# Altium project ENOCHv1.0.PrjPcb
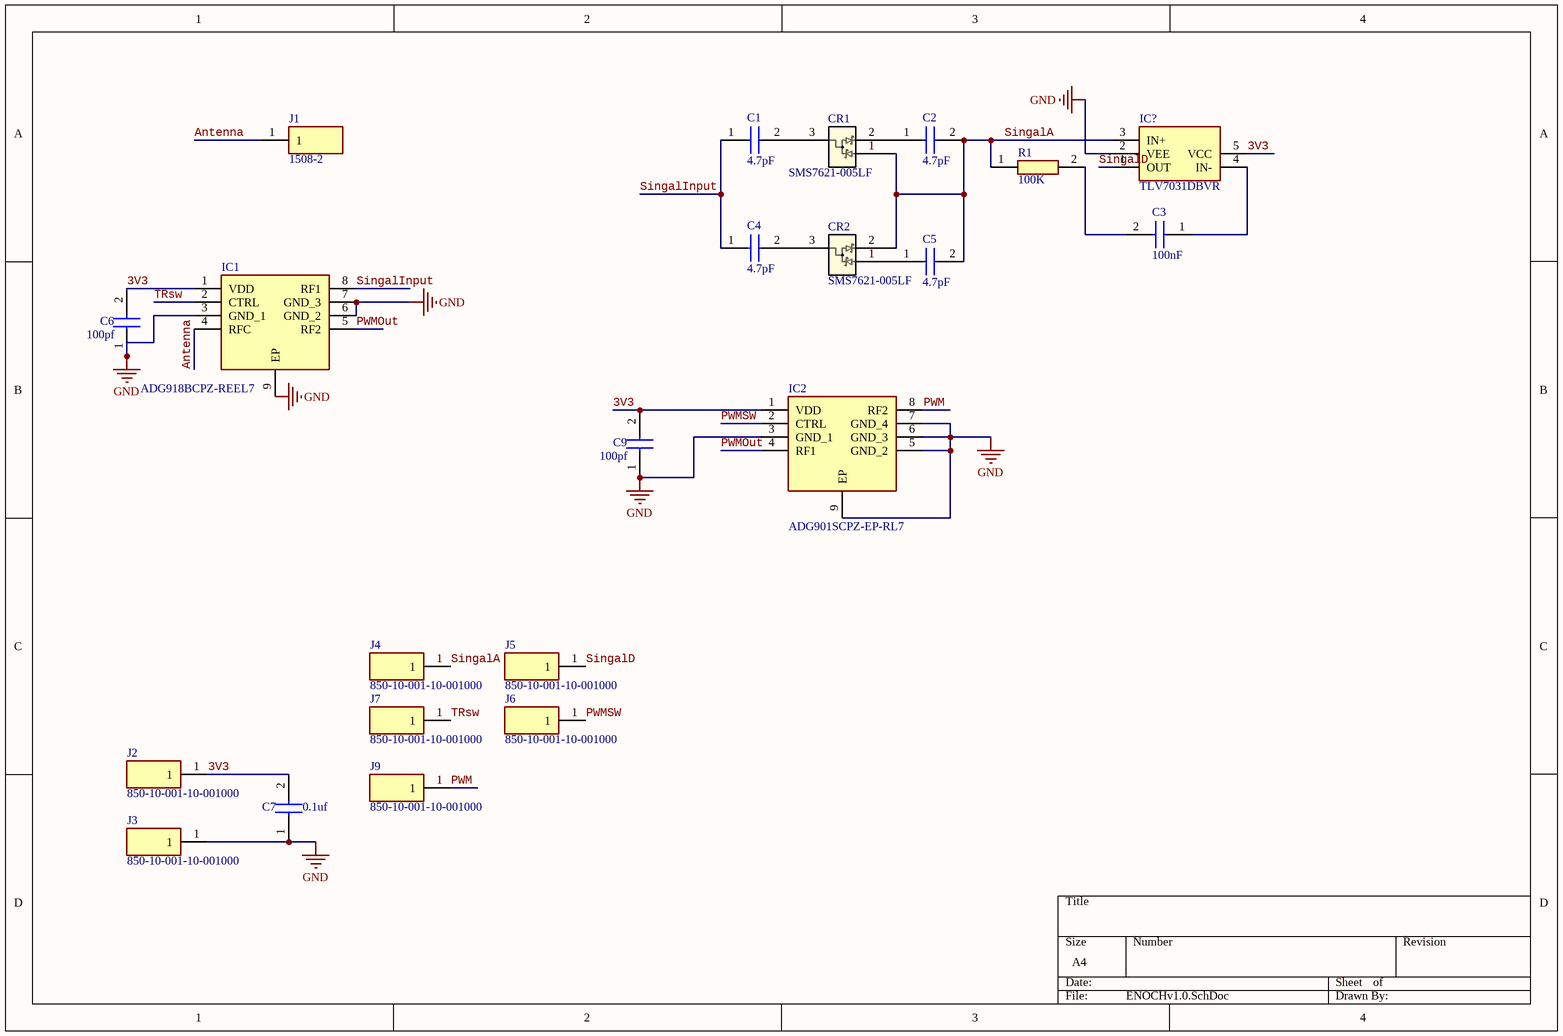
[diagram p0: ENOCHv1.0.SchDoc]
1 sheet, 22 parts. Net scope: global (net labels, ports and power ports of the same name join across sheets).
Board file: ENOCHv1.0.PcbDoc

## Sheet ENOCHv1.0.SchDoc
size A4; SheetNumber: 1; SheetTotal: 1

### Parts
C1  4.7pF  [CAPC1005X56N]
C2  4.7pF  [CAPC1005X56N]
C3  100nF  [CAPC1005X56N]
C4  4.7pF  [CAPC1005X56N]
C5  4.7pF  [CAPC1005X56N]
C6  100pf  [CAPC1005X56N]
C7  0.1uf  [CAPC1005X56N]
C9  100pf  [CAPC1005X56N]
CR1  SMS7621-005LF  [SOT23]
CR2  SMS7621-005LF  [SOT23]
IC1  ADG918BCPZ-REEL7  [SON50P300X300X85-9N-D]
IC2  ADG901SCPZ-EP-RL7  [SON50P300X300X85-9N-D]
IC?  TLV7031DBVR  [SOT95P280X145-5N]
J1  1508-2  [15082]
J2  850-10-001-10-001000  [8501000110001000]
J3  850-10-001-10-001000  [8501000110001000]
J4  850-10-001-10-001000  [8501000110001000]
J5  850-10-001-10-001000  [8501000110001000]
J6  850-10-001-10-001000  [8501000110001000]
J7  850-10-001-10-001000  [8501000110001000]
J9  850-10-001-10-001000  [8501000110001000]
R1  100K  [ERJ2RKD1004X]

### Nets
GND: C6.1 C7.1 C9.1 IC1.3(GND_1) IC1.6(GND_2) IC1.7(GND_3) IC1.9(EP) IC2.3(GND_1) IC2.5(GND_2) IC2.6(GND_3) IC2.7(GND_4) IC2.9(EP) IC?.2(VEE) J3.1
3V3: C6.2 C7.2 C9.2 IC1.1(VDD) IC2.1(VDD) IC?.5(VCC) J2.1
Antenna: IC1.4(RFC) J1.1
PWM: IC2.8(RF2) J9.1
PWMOut: IC1.5(RF2) IC2.4(RF1)
PWMSW: IC2.2(CTRL) J6.1
SingalA: C2.2 C5.2 CR1.1 CR2.2 IC?.3(IN+) J4.1 R1.1
SingalD: IC?.1(OUT) J5.1
SingalInput: C1.1 C4.1 IC1.8(RF1)
TRsw: IC1.2(CTRL) J7.1
NetC1_2: C1.2 CR1.3
NetC2_1: C2.1 CR1.2
NetC3_1: C3.1 IC?.4(IN-)
NetC3_2: C3.2 R1.2
NetC4_2: C4.2 CR2.3
NetC5_1: C5.1 CR2.1

### Library data of the parts
C1 C2 C4-C7 C9 = 0402ZA4R7CAT2A: Capacitor; Manufacturer_Name: Kyocera AVX; Datasheet Link: http://www.mouser.com/catalog/supplier/library/pdf/AVXSurfaceMountCeramic.pdf; Height: 0.56mm; Manufacturer_Part_Number: 0402ZA4R7CAT2A; Mouser Part Number: 581-0402ZA4R7CAT2A; Mouser Price/Stock: https://www.mouser.co.uk/ProductDetail/Kyocera-AVX/0402ZA4R7CAT2A?qs=ZwvTZoB9SO9MyqBkNMOKqQ%3D%3D
C3 = 04025A101KAT2A: Capacitor; Manufacturer_Name: Kyocera AVX; Datasheet Link: http://www.mouser.com/catalog/supplier/library/pdf/AVXSurfaceMountCeramic.pdf; Height: 0.56mm; Manufacturer_Part_Number: 04025A101KAT2A; Mouser Part Number: 581-04025A101KAT2A; Mouser Price/Stock: https://www.mouser.co.uk/ProductDetail/AVX/04025A101KAT2A?qs=hnOPNQ0PpSHZ7VloB%252BWZkw%3D%3D
CR1 CR2 = SMS7621-005LF: No Description Available; Mfr_Name: Skyworks; RefDes: RefDes; Type: Type
IC1 = ADG918BCPZ-REEL7: Integrated Circuit; Manufacturer_Name: Analog Devices; Datasheet Link: http://www.analog.com/media/en/technical-documentation/data-sheets/ADG918_919.pdf; Height: 0.85mm; Manufacturer_Part_Number: ADG918BCPZ-REEL7; Mouser Part Number: 584-ADG918BCPZ-R7; Mouser Price/Stock: https://www.mouser.co.uk/ProductDetail/Analog-Devices/ADG918BCPZ-REEL7?qs=BpaRKvA4VqEK8oT2sWj1IQ%3D%3D; Arrow Part Number: ADG918BCPZ-REEL7; Arrow Price/Stock: https://www.arrow.com/en/products/adg918bcpz-reel7/analog-devices?region=nac
IC2 = ADG901SCPZ-EP-RL7: Integrated Circuit; Manufacturer_Name: Analog Devices; Datasheet Link: https://www.analog.com/media/en/technical-documentation/data-sheets/ADG901-EP.pdf; Height: 0.85mm; Manufacturer_Part_Number: ADG901SCPZ-EP-RL7; Mouser Part Number: 584-ADG901SCPZEPRL7; Mouser Price/Stock: https://www.mouser.co.uk/ProductDetail/Analog-Devices/ADG901SCPZ-EP-RL7?qs=S8zVn2bBIh8DlciUwzRt2A%3D%3D; Arrow Part Number: ADG901SCPZ-EP-RL7; Arrow Price/Stock: https://www.arrow.com/en/products/adg901scpz-ep-rl7/analog-devices?region=nac
IC? = TLV7031DBVR: Integrated Circuit; Manufacturer_Name: Texas Instruments; Datasheet Link: http://www.ti.com/lit/gpn/TLV7031; Height: 1.45mm; Manufacturer_Part_Number: TLV7031DBVR; Mouser Part Number: 595-TLV7031DBVR; Mouser Price/Stock: https://www.mouser.co.uk/ProductDetail/Texas-Instruments/TLV7031DBVR?qs=EBDBlbfErPzxbC0zg598sw%3D%3D; Arrow Part Number: TLV7031DBVR; Arrow Price/Stock: https://www.arrow.com/en/products/tlv7031dbvr/texas-instruments?region=nac
J1 = 1508-2: Connector; Manufacturer_Name: Keystone Electronics; Datasheet Link: http://keyelco.com/userAssets/file/M65p142.pdf; Height: 2.36mm; Manufacturer_Part_Number: 1508-2; Mouser Part Number: 534-1508-2; Mouser Price/Stock: https://www.mouser.com/Search/Refine.aspx?Keyword=534-1508-2
J2-J7 J9 = 850-10-001-10-001000: Connector; Manufacturer_Name: Mill-Max; Datasheet Link: https://www.mill-max.com/products/datasheet/sockets/850-10-001-10-001000; Height: 5.207mm; Manufacturer_Part_Number: 850-10-001-10-001000
R1 = ERJ-2RKF1003X: Resistor; Manufacturer_Name: Panasonic; Datasheet Link: https://industrial.panasonic.com/cdbs/www-data/pdf/RDA0000/AOA0000C86.pdf; Height: 0.4mm; Manufacturer_Part_Number: ERJ-2RKF1003X; Mouser Part Number: 667-ERJ-2RKF1003X; Mouser Price/Stock: https://www.mouser.co.uk/ProductDetail/Panasonic/ERJ-2RKF1003X?qs=H7k1u0Mp9JQnXoBKdf15Qg%3D%3D; Arrow Part Number: ERJ-2RKF1003X; Arrow Price/Stock: https://www.arrow.com/en/products/erj-2rkf1003x/panasonic?region=europe